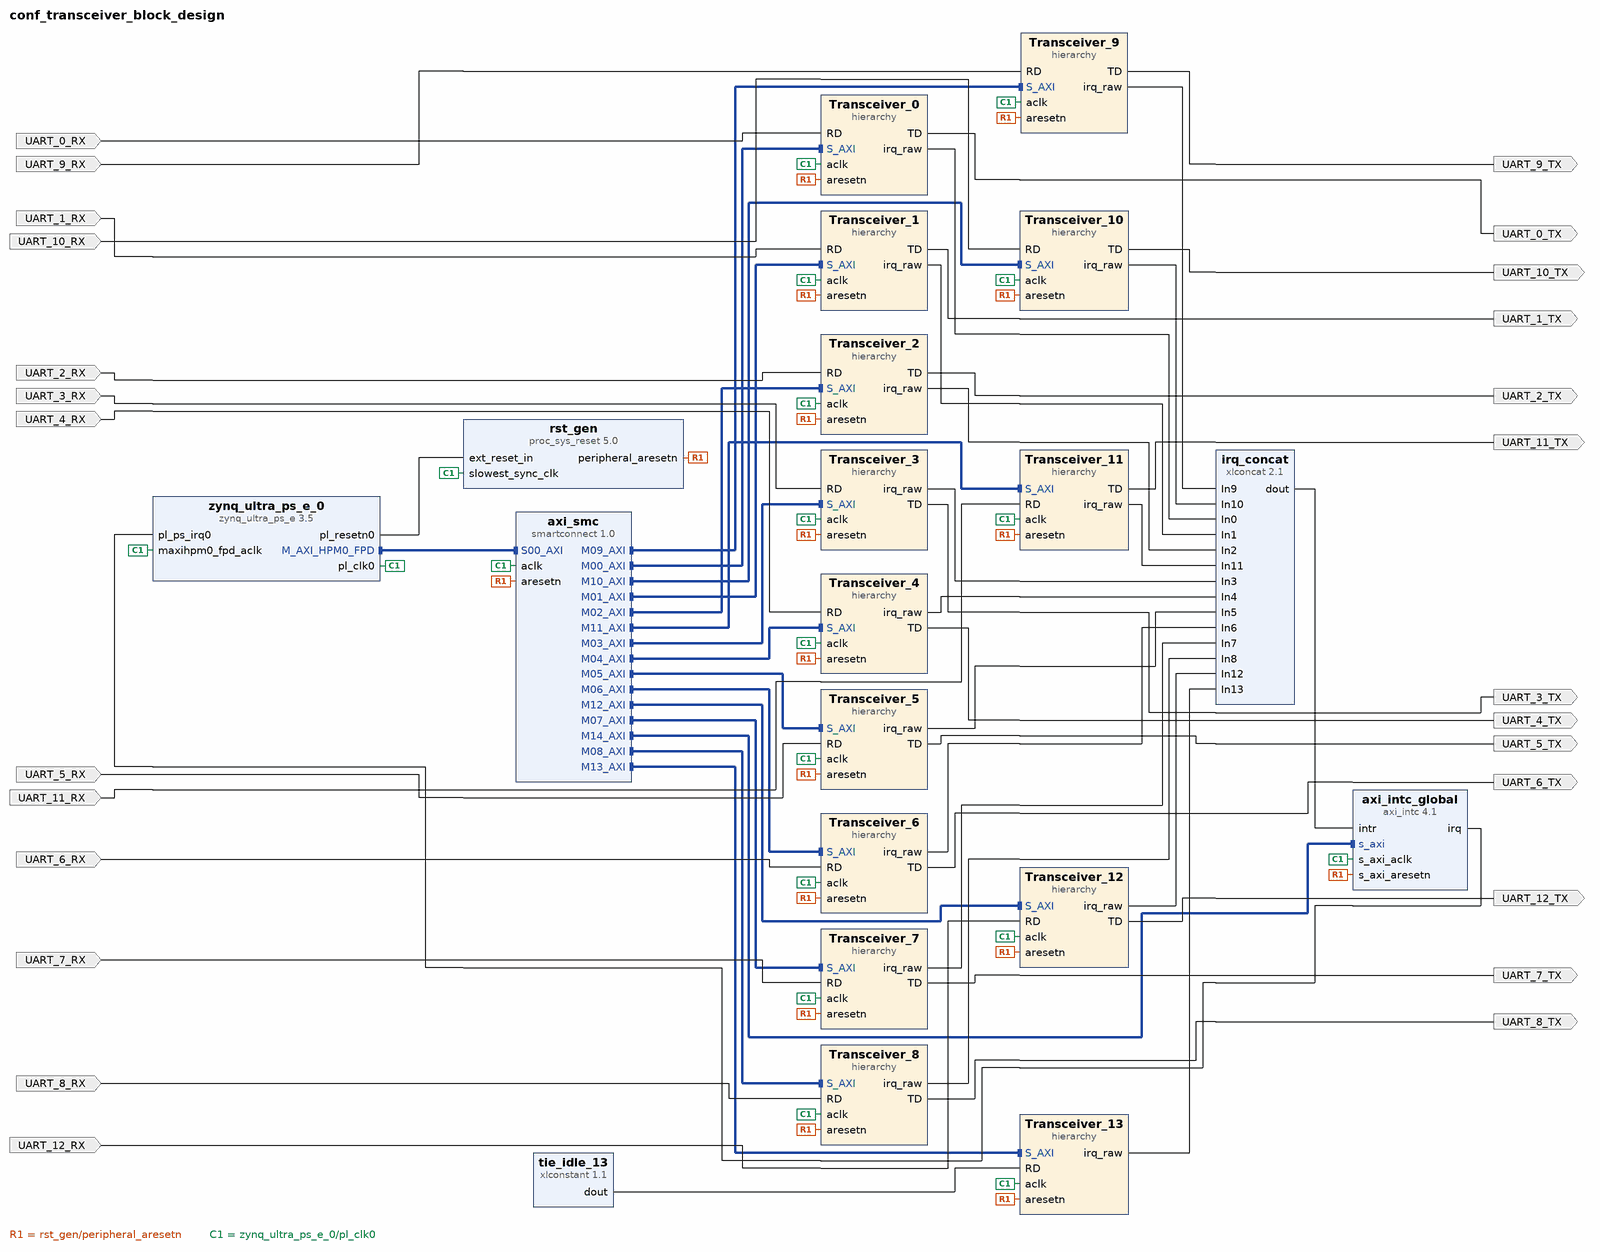
[diagram p0: block diagram of the top level]
# Vivado block design conf_transceiver_block_design, xczu9eg-ffvb1156-2-e, Vivado 2025.1
create_bd_design conf_transceiver_block_design

create_bd_port -dir I UART_0_RX
create_bd_port -dir O UART_0_TX
create_bd_port -dir I UART_1_RX
create_bd_port -dir O UART_1_TX
create_bd_port -dir I UART_2_RX
create_bd_port -dir O UART_2_TX
create_bd_port -dir I UART_3_RX
create_bd_port -dir O UART_3_TX
create_bd_port -dir I UART_4_RX
create_bd_port -dir O UART_4_TX
create_bd_port -dir I UART_5_RX
create_bd_port -dir O UART_5_TX
create_bd_port -dir I UART_6_RX
create_bd_port -dir O UART_6_TX
create_bd_port -dir I UART_7_RX
create_bd_port -dir O UART_7_TX
create_bd_port -dir I UART_8_RX
create_bd_port -dir O UART_8_TX
create_bd_port -dir I UART_9_RX
create_bd_port -dir O UART_9_TX
create_bd_port -dir I UART_10_RX
create_bd_port -dir O UART_10_TX
create_bd_port -dir I UART_11_RX
create_bd_port -dir O UART_11_TX
create_bd_port -dir I UART_12_RX
create_bd_port -dir O UART_12_TX

create_bd_cell -type ip -vlnv xilinx.com:ip:zynq_ultra_ps_e:3.5 zynq_ultra_ps_e_0
set_property -dict [list \
  CONFIG.PSU_BANK_0_IO_STANDARD LVCMOS18 \
  CONFIG.PSU_BANK_1_IO_STANDARD LVCMOS18 \
  CONFIG.PSU_BANK_2_IO_STANDARD LVCMOS18 \
  CONFIG.PSU_BANK_3_IO_STANDARD LVCMOS18 \
  CONFIG.PSU_DYNAMIC_DDR_CONFIG_EN 1 \
  CONFIG.PSU_USB3__DUAL_CLOCK_ENABLE 1 \
  CONFIG.PSU__CAN1__PERIPHERAL__ENABLE 1 \
  CONFIG.PSU__CAN1__PERIPHERAL__IO {MIO 24 .. 25} \
  CONFIG.PSU__CRF_APB__ACPU_CTRL__FREQMHZ 1200 \
  CONFIG.PSU__CRF_APB__ACPU_CTRL__SRCSEL APLL \
  CONFIG.PSU__CRF_APB__APLL_CTRL__SRCSEL PSS_REF_CLK \
  CONFIG.PSU__CRF_APB__DBG_FPD_CTRL__FREQMHZ 250 \
  CONFIG.PSU__CRF_APB__DBG_FPD_CTRL__SRCSEL IOPLL \
  CONFIG.PSU__CRF_APB__DBG_TRACE_CTRL__FREQMHZ 250 \
  CONFIG.PSU__CRF_APB__DBG_TRACE_CTRL__SRCSEL IOPLL \
  CONFIG.PSU__CRF_APB__DBG_TSTMP_CTRL__FREQMHZ 250 \
  CONFIG.PSU__CRF_APB__DBG_TSTMP_CTRL__SRCSEL IOPLL \
  CONFIG.PSU__CRF_APB__DDR_CTRL__FREQMHZ 1067 \
  CONFIG.PSU__CRF_APB__DDR_CTRL__SRCSEL DPLL \
  CONFIG.PSU__CRF_APB__DPDMA_REF_CTRL__FREQMHZ 600 \
  CONFIG.PSU__CRF_APB__DPDMA_REF_CTRL__SRCSEL APLL \
  CONFIG.PSU__CRF_APB__DPLL_CTRL__SRCSEL PSS_REF_CLK \
  CONFIG.PSU__CRF_APB__DP_AUDIO_REF_CTRL__SRCSEL RPLL \
  CONFIG.PSU__CRF_APB__DP_STC_REF_CTRL__SRCSEL RPLL \
  CONFIG.PSU__CRF_APB__DP_VIDEO_REF_CTRL__SRCSEL VPLL \
  CONFIG.PSU__CRF_APB__GDMA_REF_CTRL__FREQMHZ 600 \
  CONFIG.PSU__CRF_APB__GDMA_REF_CTRL__SRCSEL APLL \
  CONFIG.PSU__CRF_APB__GPU_REF_CTRL__FREQMHZ 500 \
  CONFIG.PSU__CRF_APB__GPU_REF_CTRL__SRCSEL IOPLL \
  CONFIG.PSU__CRF_APB__TOPSW_LSBUS_CTRL__FREQMHZ 100 \
  CONFIG.PSU__CRF_APB__TOPSW_LSBUS_CTRL__SRCSEL IOPLL \
  CONFIG.PSU__CRF_APB__TOPSW_MAIN_CTRL__FREQMHZ 533.33 \
  CONFIG.PSU__CRF_APB__TOPSW_MAIN_CTRL__SRCSEL DPLL \
  CONFIG.PSU__CRF_APB__VPLL_CTRL__SRCSEL PSS_REF_CLK \
  CONFIG.PSU__CRL_APB__ADMA_REF_CTRL__FREQMHZ 500 \
  CONFIG.PSU__CRL_APB__ADMA_REF_CTRL__SRCSEL IOPLL \
  CONFIG.PSU__CRL_APB__CAN1_REF_CTRL__FREQMHZ 100 \
  CONFIG.PSU__CRL_APB__CAN1_REF_CTRL__SRCSEL IOPLL \
  CONFIG.PSU__CRL_APB__CPU_R5_CTRL__FREQMHZ 500 \
  CONFIG.PSU__CRL_APB__CPU_R5_CTRL__SRCSEL IOPLL \
  CONFIG.PSU__CRL_APB__DBG_LPD_CTRL__FREQMHZ 250 \
  CONFIG.PSU__CRL_APB__DBG_LPD_CTRL__SRCSEL IOPLL \
  CONFIG.PSU__CRL_APB__GEM3_REF_CTRL__FREQMHZ 125 \
  CONFIG.PSU__CRL_APB__GEM3_REF_CTRL__SRCSEL IOPLL \
  CONFIG.PSU__CRL_APB__I2C0_REF_CTRL__FREQMHZ 100 \
  CONFIG.PSU__CRL_APB__I2C0_REF_CTRL__SRCSEL IOPLL \
  CONFIG.PSU__CRL_APB__I2C1_REF_CTRL__FREQMHZ 100 \
  CONFIG.PSU__CRL_APB__I2C1_REF_CTRL__SRCSEL IOPLL \
  CONFIG.PSU__CRL_APB__IOPLL_CTRL__SRCSEL PSS_REF_CLK \
  CONFIG.PSU__CRL_APB__IOU_SWITCH_CTRL__FREQMHZ 250 \
  CONFIG.PSU__CRL_APB__IOU_SWITCH_CTRL__SRCSEL IOPLL \
  CONFIG.PSU__CRL_APB__LPD_LSBUS_CTRL__FREQMHZ 100 \
  CONFIG.PSU__CRL_APB__LPD_LSBUS_CTRL__SRCSEL IOPLL \
  CONFIG.PSU__CRL_APB__LPD_SWITCH_CTRL__FREQMHZ 500 \
  CONFIG.PSU__CRL_APB__LPD_SWITCH_CTRL__SRCSEL IOPLL \
  CONFIG.PSU__CRL_APB__PCAP_CTRL__FREQMHZ 200 \
  CONFIG.PSU__CRL_APB__PCAP_CTRL__SRCSEL IOPLL \
  CONFIG.PSU__CRL_APB__PL0_REF_CTRL__FREQMHZ 100 \
  CONFIG.PSU__CRL_APB__PL0_REF_CTRL__SRCSEL IOPLL \
  CONFIG.PSU__CRL_APB__QSPI_REF_CTRL__FREQMHZ 125 \
  CONFIG.PSU__CRL_APB__QSPI_REF_CTRL__SRCSEL IOPLL \
  CONFIG.PSU__CRL_APB__RPLL_CTRL__SRCSEL PSS_REF_CLK \
  CONFIG.PSU__CRL_APB__SDIO1_REF_CTRL__FREQMHZ 200 \
  CONFIG.PSU__CRL_APB__SDIO1_REF_CTRL__SRCSEL IOPLL \
  CONFIG.PSU__CRL_APB__TIMESTAMP_REF_CTRL__FREQMHZ 100 \
  CONFIG.PSU__CRL_APB__TIMESTAMP_REF_CTRL__SRCSEL IOPLL \
  CONFIG.PSU__CRL_APB__UART0_REF_CTRL__FREQMHZ 100 \
  CONFIG.PSU__CRL_APB__UART0_REF_CTRL__SRCSEL IOPLL \
  CONFIG.PSU__CRL_APB__UART1_REF_CTRL__FREQMHZ 100 \
  CONFIG.PSU__CRL_APB__UART1_REF_CTRL__SRCSEL IOPLL \
  CONFIG.PSU__CRL_APB__USB0_BUS_REF_CTRL__FREQMHZ 250 \
  CONFIG.PSU__CRL_APB__USB0_BUS_REF_CTRL__SRCSEL IOPLL \
  CONFIG.PSU__CRL_APB__USB3_DUAL_REF_CTRL__FREQMHZ 20 \
  CONFIG.PSU__CRL_APB__USB3_DUAL_REF_CTRL__SRCSEL IOPLL \
  CONFIG.PSU__CRL_APB__USB3__ENABLE 1 \
  CONFIG.PSU__CSUPMU__PERIPHERAL__VALID 1 \
  CONFIG.PSU__DDRC__BUS_WIDTH {64 Bit} \
  CONFIG.PSU__DDRC__COMPONENTS UDIMM \
  CONFIG.PSU__DDRC__DEVICE_CAPACITY {4096 MBits} \
  CONFIG.PSU__DDRC__DRAM_WIDTH {8 Bits} \
  CONFIG.PSU__DDRC__ECC Disabled \
  CONFIG.PSU__DDRC__MEMORY_TYPE {DDR 4} \
  CONFIG.PSU__DDRC__SPEED_BIN DDR4_2133P \
  CONFIG.PSU__DDR_HIGH_ADDRESS_GUI_ENABLE 1 \
  CONFIG.PSU__DDR__INTERFACE__FREQMHZ 533.500 \
  CONFIG.PSU__DISPLAYPORT__LANE0__ENABLE 1 \
  CONFIG.PSU__DISPLAYPORT__LANE0__IO {GT Lane1} \
  CONFIG.PSU__DISPLAYPORT__LANE1__ENABLE 0 \
  CONFIG.PSU__DISPLAYPORT__PERIPHERAL__ENABLE 1 \
  CONFIG.PSU__DLL__ISUSED 1 \
  CONFIG.PSU__DPAUX__PERIPHERAL__ENABLE 1 \
  CONFIG.PSU__DPAUX__PERIPHERAL__IO {MIO 27 .. 30} \
  CONFIG.PSU__DP__LANE_SEL {Single Lower} \
  CONFIG.PSU__DP__REF_CLK_FREQ 27 \
  CONFIG.PSU__DP__REF_CLK_SEL {Ref Clk3} \
  CONFIG.PSU__ENET3__FIFO__ENABLE 0 \
  CONFIG.PSU__ENET3__GRP_MDIO__ENABLE 1 \
  CONFIG.PSU__ENET3__GRP_MDIO__IO {MIO 76 .. 77} \
  CONFIG.PSU__ENET3__PERIPHERAL__ENABLE 1 \
  CONFIG.PSU__ENET3__PERIPHERAL__IO {MIO 64 .. 75} \
  CONFIG.PSU__ENET3__PTP__ENABLE 0 \
  CONFIG.PSU__ENET3__TSU__ENABLE 0 \
  CONFIG.PSU__FPGA_PL0_ENABLE 1 \
  CONFIG.PSU__GEM3_COHERENCY 0 \
  CONFIG.PSU__GEM3_ROUTE_THROUGH_FPD 0 \
  CONFIG.PSU__GEM__TSU__ENABLE 0 \
  CONFIG.PSU__GPIO0_MIO__IO {MIO 0 .. 25} \
  CONFIG.PSU__GPIO0_MIO__PERIPHERAL__ENABLE 1 \
  CONFIG.PSU__GPIO1_MIO__IO {MIO 26 .. 51} \
  CONFIG.PSU__GPIO1_MIO__PERIPHERAL__ENABLE 1 \
  CONFIG.PSU__GT__LINK_SPEED HBR \
  CONFIG.PSU__GT__PRE_EMPH_LVL_4 0 \
  CONFIG.PSU__GT__VLT_SWNG_LVL_4 0 \
  CONFIG.PSU__I2C0__PERIPHERAL__ENABLE 1 \
  CONFIG.PSU__I2C0__PERIPHERAL__IO {MIO 14 .. 15} \
  CONFIG.PSU__I2C1__PERIPHERAL__ENABLE 1 \
  CONFIG.PSU__I2C1__PERIPHERAL__IO {MIO 16 .. 17} \
  CONFIG.PSU__IOU_SLCR__IOU_TTC_APB_CLK__TTC0_SEL APB \
  CONFIG.PSU__IOU_SLCR__IOU_TTC_APB_CLK__TTC1_SEL APB \
  CONFIG.PSU__IOU_SLCR__IOU_TTC_APB_CLK__TTC2_SEL APB \
  CONFIG.PSU__IOU_SLCR__IOU_TTC_APB_CLK__TTC3_SEL APB \
  CONFIG.PSU__MAXIGP0__DATA_WIDTH 128 \
  CONFIG.PSU__OVERRIDE__BASIC_CLOCK 0 \
  CONFIG.PSU__PCIE__BAR0_VAL 0x0 \
  CONFIG.PSU__PCIE__BAR1_VAL 0x0 \
  CONFIG.PSU__PCIE__BAR2_VAL 0x0 \
  CONFIG.PSU__PCIE__BAR3_VAL 0x0 \
  CONFIG.PSU__PCIE__BAR4_VAL 0x0 \
  CONFIG.PSU__PCIE__BAR5_VAL 0x0 \
  CONFIG.PSU__PCIE__CLASS_CODE_BASE 0x06 \
  CONFIG.PSU__PCIE__CLASS_CODE_INTERFACE 0x0 \
  CONFIG.PSU__PCIE__CLASS_CODE_SUB 0x4 \
  CONFIG.PSU__PCIE__CLASS_CODE_VALUE 0x60400 \
  CONFIG.PSU__PCIE__CRS_SW_VISIBILITY 1 \
  CONFIG.PSU__PCIE__DEVICE_ID 0xD021 \
  CONFIG.PSU__PCIE__DEVICE_PORT_TYPE {Root Port} \
  CONFIG.PSU__PCIE__EROM_VAL 0x0 \
  CONFIG.PSU__PCIE__LANE0__ENABLE 1 \
  CONFIG.PSU__PCIE__LANE0__IO {GT Lane0} \
  CONFIG.PSU__PCIE__LINK_SPEED {5.0 Gb/s} \
  CONFIG.PSU__PCIE__MAXIMUM_LINK_WIDTH x1 \
  CONFIG.PSU__PCIE__MAX_PAYLOAD_SIZE {256 bytes} \
  CONFIG.PSU__PCIE__PERIPHERAL__ENABLE 1 \
  CONFIG.PSU__PCIE__PERIPHERAL__ENDPOINT_ENABLE 0 \
  CONFIG.PSU__PCIE__PERIPHERAL__ROOTPORT_ENABLE 1 \
  CONFIG.PSU__PCIE__PERIPHERAL__ROOTPORT_IO {MIO 31} \
  CONFIG.PSU__PCIE__REF_CLK_FREQ 100 \
  CONFIG.PSU__PCIE__REF_CLK_SEL {Ref Clk0} \
  CONFIG.PSU__PCIE__REVISION_ID 0x0 \
  CONFIG.PSU__PCIE__SUBSYSTEM_ID 0x7 \
  CONFIG.PSU__PCIE__SUBSYSTEM_VENDOR_ID 0x10EE \
  CONFIG.PSU__PCIE__VENDOR_ID 0x10EE \
  CONFIG.PSU__PMU_COHERENCY 0 \
  CONFIG.PSU__PMU__AIBACK__ENABLE 0 \
  CONFIG.PSU__PMU__EMIO_GPI__ENABLE 0 \
  CONFIG.PSU__PMU__EMIO_GPO__ENABLE 0 \
  CONFIG.PSU__PMU__GPI0__ENABLE 0 \
  CONFIG.PSU__PMU__GPI1__ENABLE 0 \
  CONFIG.PSU__PMU__GPI2__ENABLE 0 \
  CONFIG.PSU__PMU__GPI3__ENABLE 0 \
  CONFIG.PSU__PMU__GPI4__ENABLE 0 \
  CONFIG.PSU__PMU__GPI5__ENABLE 0 \
  CONFIG.PSU__PMU__GPO0__ENABLE 0 \
  CONFIG.PSU__PMU__GPO1__ENABLE 0 \
  CONFIG.PSU__PMU__GPO2__ENABLE 1 \
  CONFIG.PSU__PMU__GPO2__IO {MIO 34} \
  CONFIG.PSU__PMU__GPO2__POLARITY high \
  CONFIG.PSU__PMU__GPO3__ENABLE 0 \
  CONFIG.PSU__PMU__GPO4__ENABLE 0 \
  CONFIG.PSU__PMU__GPO5__ENABLE 0 \
  CONFIG.PSU__PMU__PERIPHERAL__ENABLE 1 \
  CONFIG.PSU__PMU__PLERROR__ENABLE 0 \
  CONFIG.PSU__PRESET_APPLIED 1 \
  CONFIG.PSU__PSS_REF_CLK__FREQMHZ 33.330 \
  CONFIG.PSU__QSPI_COHERENCY 0 \
  CONFIG.PSU__QSPI_ROUTE_THROUGH_FPD 0 \
  CONFIG.PSU__QSPI__GRP_FBCLK__ENABLE 1 \
  CONFIG.PSU__QSPI__GRP_FBCLK__IO {MIO 6} \
  CONFIG.PSU__QSPI__PERIPHERAL__DATA_MODE x4 \
  CONFIG.PSU__QSPI__PERIPHERAL__ENABLE 1 \
  CONFIG.PSU__QSPI__PERIPHERAL__IO {MIO 0 .. 12} \
  CONFIG.PSU__QSPI__PERIPHERAL__MODE {Dual Parallel} \
  CONFIG.PSU__SATA__LANE1__IO {GT Lane3} \
  CONFIG.PSU__SATA__PERIPHERAL__ENABLE 1 \
  CONFIG.PSU__SATA__REF_CLK_FREQ 125 \
  CONFIG.PSU__SATA__REF_CLK_SEL {Ref Clk1} \
  CONFIG.PSU__SD1_COHERENCY 0 \
  CONFIG.PSU__SD1_ROUTE_THROUGH_FPD 0 \
  CONFIG.PSU__SD1__CLK_100_SDR_OTAP_DLY 0x3 \
  CONFIG.PSU__SD1__CLK_200_SDR_OTAP_DLY 0x3 \
  CONFIG.PSU__SD1__CLK_50_DDR_ITAP_DLY 0x3D \
  CONFIG.PSU__SD1__CLK_50_DDR_OTAP_DLY 0x4 \
  CONFIG.PSU__SD1__CLK_50_SDR_ITAP_DLY 0x15 \
  CONFIG.PSU__SD1__CLK_50_SDR_OTAP_DLY 0x5 \
  CONFIG.PSU__SD1__DATA_TRANSFER_MODE 8Bit \
  CONFIG.PSU__SD1__GRP_CD__ENABLE 1 \
  CONFIG.PSU__SD1__GRP_CD__IO {MIO 45} \
  CONFIG.PSU__SD1__GRP_POW__ENABLE 0 \
  CONFIG.PSU__SD1__GRP_WP__ENABLE 1 \
  CONFIG.PSU__SD1__GRP_WP__IO {MIO 44} \
  CONFIG.PSU__SD1__PERIPHERAL__ENABLE 1 \
  CONFIG.PSU__SD1__PERIPHERAL__IO {MIO 39 .. 51} \
  CONFIG.PSU__SD1__SLOT_TYPE {SD 3.0} \
  CONFIG.PSU__SWDT0__CLOCK__ENABLE 0 \
  CONFIG.PSU__SWDT0__PERIPHERAL__ENABLE 1 \
  CONFIG.PSU__SWDT0__RESET__ENABLE 0 \
  CONFIG.PSU__SWDT1__CLOCK__ENABLE 0 \
  CONFIG.PSU__SWDT1__PERIPHERAL__ENABLE 1 \
  CONFIG.PSU__SWDT1__RESET__ENABLE 0 \
  CONFIG.PSU__TSU__BUFG_PORT_PAIR 0 \
  CONFIG.PSU__TTC0__CLOCK__ENABLE 0 \
  CONFIG.PSU__TTC0__PERIPHERAL__ENABLE 1 \
  CONFIG.PSU__TTC0__WAVEOUT__ENABLE 0 \
  CONFIG.PSU__TTC1__CLOCK__ENABLE 0 \
  CONFIG.PSU__TTC1__PERIPHERAL__ENABLE 1 \
  CONFIG.PSU__TTC1__WAVEOUT__ENABLE 0 \
  CONFIG.PSU__TTC2__CLOCK__ENABLE 0 \
  CONFIG.PSU__TTC2__PERIPHERAL__ENABLE 1 \
  CONFIG.PSU__TTC2__WAVEOUT__ENABLE 0 \
  CONFIG.PSU__TTC3__CLOCK__ENABLE 0 \
  CONFIG.PSU__TTC3__PERIPHERAL__ENABLE 1 \
  CONFIG.PSU__TTC3__WAVEOUT__ENABLE 0 \
  CONFIG.PSU__UART0__BAUD_RATE 115200 \
  CONFIG.PSU__UART0__MODEM__ENABLE 0 \
  CONFIG.PSU__UART0__PERIPHERAL__ENABLE 1 \
  CONFIG.PSU__UART0__PERIPHERAL__IO {MIO 18 .. 19} \
  CONFIG.PSU__UART1__BAUD_RATE 115200 \
  CONFIG.PSU__UART1__MODEM__ENABLE 0 \
  CONFIG.PSU__UART1__PERIPHERAL__ENABLE 1 \
  CONFIG.PSU__UART1__PERIPHERAL__IO {MIO 20 .. 21} \
  CONFIG.PSU__USB0_COHERENCY 0 \
  CONFIG.PSU__USB0__PERIPHERAL__ENABLE 1 \
  CONFIG.PSU__USB0__PERIPHERAL__IO {MIO 52 .. 63} \
  CONFIG.PSU__USB0__REF_CLK_FREQ 26 \
  CONFIG.PSU__USB0__REF_CLK_SEL {Ref Clk2} \
  CONFIG.PSU__USB2_0__EMIO__ENABLE 0 \
  CONFIG.PSU__USB3_0__EMIO__ENABLE 0 \
  CONFIG.PSU__USB3_0__PERIPHERAL__ENABLE 1 \
  CONFIG.PSU__USB3_0__PERIPHERAL__IO {GT Lane2} \
  CONFIG.PSU__USB__RESET__MODE {Boot Pin} \
  CONFIG.PSU__USB__RESET__POLARITY {Active Low} \
  CONFIG.PSU__USE__IRQ0 1 \
  CONFIG.PSU__USE__M_AXI_GP0 1 \
  CONFIG.PSU__USE__M_AXI_GP1 0 \
  CONFIG.PSU__USE__M_AXI_GP2 0 \
] [get_bd_cells zynq_ultra_ps_e_0]
# 111 more settings of zynq_ultra_ps_e_0 are not shown: defaults, MIO pin electricals, DDR timing, and values the tool derives
create_bd_cell -type ip -vlnv xilinx.com:ip:proc_sys_reset:5.0 rst_gen
create_bd_cell -type ip -vlnv xilinx.com:ip:smartconnect:1.0 axi_smc
set_property -dict {CONFIG.NUM_MI 15 CONFIG.NUM_SI 1} [get_bd_cells axi_smc]
create_bd_cell -type ip -vlnv xilinx.com:ip:xlconcat:2.1 irq_concat
set_property -dict {CONFIG.NUM_PORTS 14} [get_bd_cells irq_concat]
create_bd_cell -type ip -vlnv xilinx.com:ip:axi_intc:4.1 axi_intc_global
set_property -dict [list \
  CONFIG.C_IRQ_CONNECTION 1 \
  CONFIG.C_KIND_OF_EDGE 0x0AAAAAAA \
  CONFIG.C_KIND_OF_INTR 0xFFFFFFFF \
] [get_bd_cells axi_intc_global]
create_bd_cell -type hier Transceiver_0
create_bd_cell -type hier Transceiver_1
create_bd_cell -type hier Transceiver_2
create_bd_cell -type hier Transceiver_3
create_bd_cell -type hier Transceiver_4
create_bd_cell -type hier Transceiver_5
create_bd_cell -type hier Transceiver_6
create_bd_cell -type hier Transceiver_7
create_bd_cell -type hier Transceiver_8
create_bd_cell -type hier Transceiver_9
create_bd_cell -type hier Transceiver_10
create_bd_cell -type hier Transceiver_11
create_bd_cell -type hier Transceiver_12
create_bd_cell -type hier Transceiver_13
create_bd_cell -type ip -vlnv xilinx.com:ip:xlconstant:1.1 tie_idle_13
set_property -dict {CONFIG.CONST_VAL 1} [get_bd_cells tie_idle_13]

# ---- hierarchy /Transceiver_0 ----
current_bd_instance /Transceiver_0
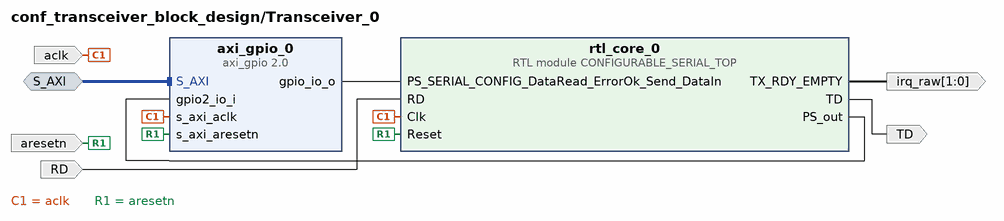
[diagram p1: block diagram inside /Transceiver_0]
create_bd_intf_pin -mode Slave -vlnv xilinx.com:interface:aximm_rtl:1.0 S_AXI
create_bd_pin -dir I -type clk aclk
create_bd_pin -dir I -type rst aresetn
create_bd_pin -dir I RD
create_bd_pin -dir O TD
create_bd_pin -dir O -from 1 -to 0 irq_raw

create_bd_cell -type module -reference CONFIGURABLE_SERIAL_TOP rtl_core_0
create_bd_cell -type ip -vlnv xilinx.com:ip:axi_gpio:2.0 axi_gpio_0
set_property -dict [list \
  CONFIG.C_ALL_INPUTS_2 1 \
  CONFIG.C_ALL_OUTPUTS 1 \
  CONFIG.C_GPIO2_WIDTH 14 \
  CONFIG.C_GPIO_WIDTH 27 \
  CONFIG.C_IS_DUAL 1 \
] [get_bd_cells axi_gpio_0]

# ---- hierarchy /Transceiver_1 ----
current_bd_instance /Transceiver_1
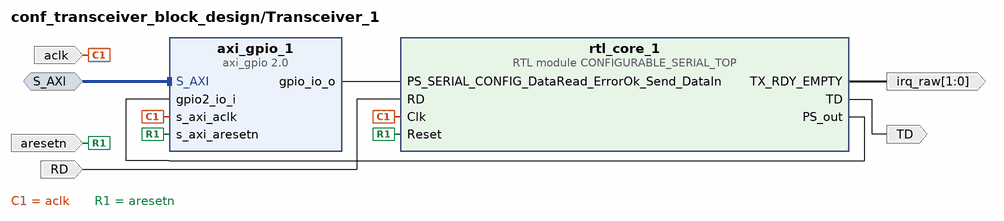
[diagram p2: block diagram inside /Transceiver_1]
create_bd_intf_pin -mode Slave -vlnv xilinx.com:interface:aximm_rtl:1.0 S_AXI
create_bd_pin -dir I -type clk aclk
create_bd_pin -dir I -type rst aresetn
create_bd_pin -dir I RD
create_bd_pin -dir O TD
create_bd_pin -dir O -from 1 -to 0 irq_raw

create_bd_cell -type module -reference CONFIGURABLE_SERIAL_TOP rtl_core_1
create_bd_cell -type ip -vlnv xilinx.com:ip:axi_gpio:2.0 axi_gpio_1
set_property -dict [list \
  CONFIG.C_ALL_INPUTS_2 1 \
  CONFIG.C_ALL_OUTPUTS 1 \
  CONFIG.C_GPIO2_WIDTH 14 \
  CONFIG.C_GPIO_WIDTH 27 \
  CONFIG.C_IS_DUAL 1 \
] [get_bd_cells axi_gpio_1]

# ---- hierarchy /Transceiver_2 ----
current_bd_instance /Transceiver_2
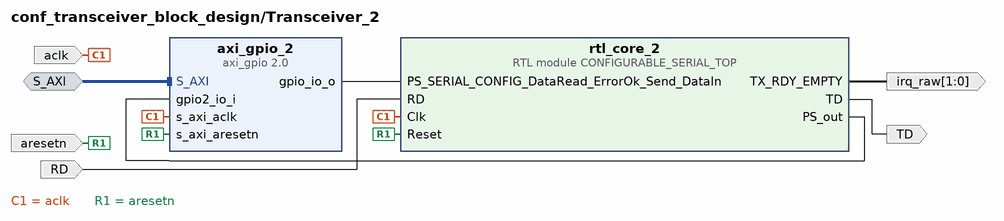
[diagram p3: block diagram inside /Transceiver_2]
create_bd_intf_pin -mode Slave -vlnv xilinx.com:interface:aximm_rtl:1.0 S_AXI
create_bd_pin -dir I -type clk aclk
create_bd_pin -dir I -type rst aresetn
create_bd_pin -dir I RD
create_bd_pin -dir O TD
create_bd_pin -dir O -from 1 -to 0 irq_raw

create_bd_cell -type module -reference CONFIGURABLE_SERIAL_TOP rtl_core_2
create_bd_cell -type ip -vlnv xilinx.com:ip:axi_gpio:2.0 axi_gpio_2
set_property -dict [list \
  CONFIG.C_ALL_INPUTS_2 1 \
  CONFIG.C_ALL_OUTPUTS 1 \
  CONFIG.C_GPIO2_WIDTH 14 \
  CONFIG.C_GPIO_WIDTH 27 \
  CONFIG.C_IS_DUAL 1 \
] [get_bd_cells axi_gpio_2]

# ---- hierarchy /Transceiver_3 ----
current_bd_instance /Transceiver_3
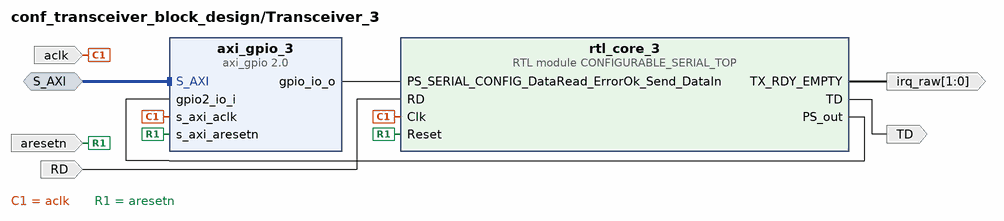
[diagram p4: block diagram inside /Transceiver_3]
create_bd_intf_pin -mode Slave -vlnv xilinx.com:interface:aximm_rtl:1.0 S_AXI
create_bd_pin -dir I -type clk aclk
create_bd_pin -dir I -type rst aresetn
create_bd_pin -dir I RD
create_bd_pin -dir O TD
create_bd_pin -dir O -from 1 -to 0 irq_raw

create_bd_cell -type module -reference CONFIGURABLE_SERIAL_TOP rtl_core_3
create_bd_cell -type ip -vlnv xilinx.com:ip:axi_gpio:2.0 axi_gpio_3
set_property -dict [list \
  CONFIG.C_ALL_INPUTS_2 1 \
  CONFIG.C_ALL_OUTPUTS 1 \
  CONFIG.C_GPIO2_WIDTH 14 \
  CONFIG.C_GPIO_WIDTH 27 \
  CONFIG.C_IS_DUAL 1 \
] [get_bd_cells axi_gpio_3]

# ---- hierarchy /Transceiver_4 ----
current_bd_instance /Transceiver_4
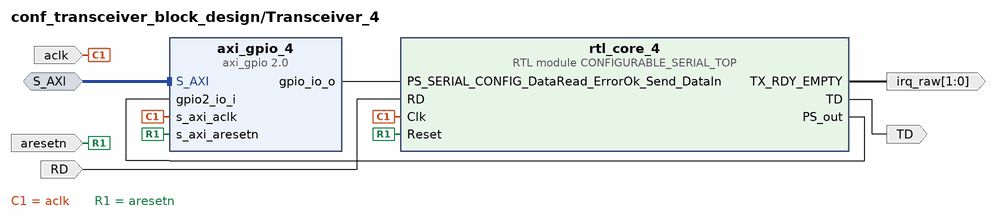
[diagram p5: block diagram inside /Transceiver_4]
create_bd_intf_pin -mode Slave -vlnv xilinx.com:interface:aximm_rtl:1.0 S_AXI
create_bd_pin -dir I -type clk aclk
create_bd_pin -dir I -type rst aresetn
create_bd_pin -dir I RD
create_bd_pin -dir O TD
create_bd_pin -dir O -from 1 -to 0 irq_raw

create_bd_cell -type module -reference CONFIGURABLE_SERIAL_TOP rtl_core_4
create_bd_cell -type ip -vlnv xilinx.com:ip:axi_gpio:2.0 axi_gpio_4
set_property -dict [list \
  CONFIG.C_ALL_INPUTS_2 1 \
  CONFIG.C_ALL_OUTPUTS 1 \
  CONFIG.C_GPIO2_WIDTH 14 \
  CONFIG.C_GPIO_WIDTH 27 \
  CONFIG.C_IS_DUAL 1 \
] [get_bd_cells axi_gpio_4]

# ---- hierarchy /Transceiver_5 ----
current_bd_instance /Transceiver_5
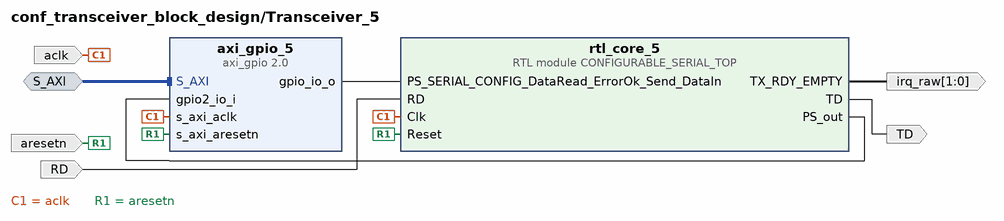
[diagram p6: block diagram inside /Transceiver_5]
create_bd_intf_pin -mode Slave -vlnv xilinx.com:interface:aximm_rtl:1.0 S_AXI
create_bd_pin -dir I -type clk aclk
create_bd_pin -dir I -type rst aresetn
create_bd_pin -dir I RD
create_bd_pin -dir O TD
create_bd_pin -dir O -from 1 -to 0 irq_raw

create_bd_cell -type module -reference CONFIGURABLE_SERIAL_TOP rtl_core_5
create_bd_cell -type ip -vlnv xilinx.com:ip:axi_gpio:2.0 axi_gpio_5
set_property -dict [list \
  CONFIG.C_ALL_INPUTS_2 1 \
  CONFIG.C_ALL_OUTPUTS 1 \
  CONFIG.C_GPIO2_WIDTH 14 \
  CONFIG.C_GPIO_WIDTH 27 \
  CONFIG.C_IS_DUAL 1 \
] [get_bd_cells axi_gpio_5]

# ---- hierarchy /Transceiver_6 ----
current_bd_instance /Transceiver_6
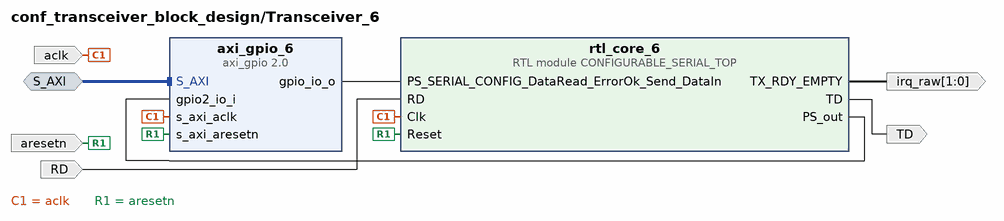
[diagram p7: block diagram inside /Transceiver_6]
create_bd_intf_pin -mode Slave -vlnv xilinx.com:interface:aximm_rtl:1.0 S_AXI
create_bd_pin -dir I -type clk aclk
create_bd_pin -dir I -type rst aresetn
create_bd_pin -dir I RD
create_bd_pin -dir O TD
create_bd_pin -dir O -from 1 -to 0 irq_raw

create_bd_cell -type module -reference CONFIGURABLE_SERIAL_TOP rtl_core_6
create_bd_cell -type ip -vlnv xilinx.com:ip:axi_gpio:2.0 axi_gpio_6
set_property -dict [list \
  CONFIG.C_ALL_INPUTS_2 1 \
  CONFIG.C_ALL_OUTPUTS 1 \
  CONFIG.C_GPIO2_WIDTH 14 \
  CONFIG.C_GPIO_WIDTH 27 \
  CONFIG.C_IS_DUAL 1 \
] [get_bd_cells axi_gpio_6]

# ---- hierarchy /Transceiver_7 ----
current_bd_instance /Transceiver_7
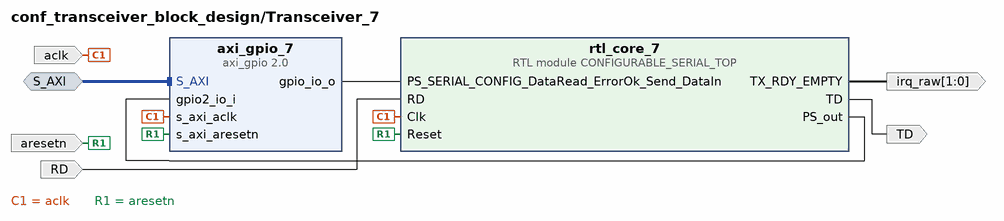
[diagram p8: block diagram inside /Transceiver_7]
create_bd_intf_pin -mode Slave -vlnv xilinx.com:interface:aximm_rtl:1.0 S_AXI
create_bd_pin -dir I -type clk aclk
create_bd_pin -dir I -type rst aresetn
create_bd_pin -dir I RD
create_bd_pin -dir O TD
create_bd_pin -dir O -from 1 -to 0 irq_raw

create_bd_cell -type module -reference CONFIGURABLE_SERIAL_TOP rtl_core_7
create_bd_cell -type ip -vlnv xilinx.com:ip:axi_gpio:2.0 axi_gpio_7
set_property -dict [list \
  CONFIG.C_ALL_INPUTS_2 1 \
  CONFIG.C_ALL_OUTPUTS 1 \
  CONFIG.C_GPIO2_WIDTH 14 \
  CONFIG.C_GPIO_WIDTH 27 \
  CONFIG.C_IS_DUAL 1 \
] [get_bd_cells axi_gpio_7]

# ---- hierarchy /Transceiver_8 ----
current_bd_instance /Transceiver_8
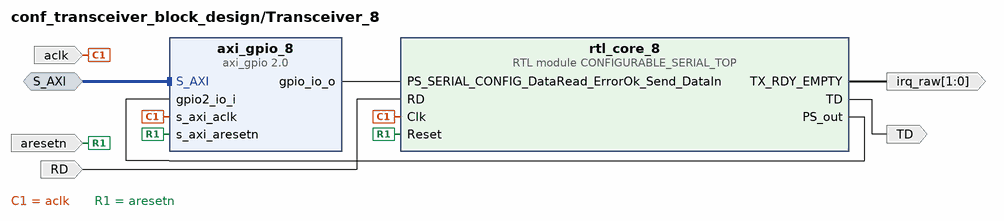
[diagram p9: block diagram inside /Transceiver_8]
create_bd_intf_pin -mode Slave -vlnv xilinx.com:interface:aximm_rtl:1.0 S_AXI
create_bd_pin -dir I -type clk aclk
create_bd_pin -dir I -type rst aresetn
create_bd_pin -dir I RD
create_bd_pin -dir O TD
create_bd_pin -dir O -from 1 -to 0 irq_raw

create_bd_cell -type module -reference CONFIGURABLE_SERIAL_TOP rtl_core_8
create_bd_cell -type ip -vlnv xilinx.com:ip:axi_gpio:2.0 axi_gpio_8
set_property -dict [list \
  CONFIG.C_ALL_INPUTS_2 1 \
  CONFIG.C_ALL_OUTPUTS 1 \
  CONFIG.C_GPIO2_WIDTH 14 \
  CONFIG.C_GPIO_WIDTH 27 \
  CONFIG.C_IS_DUAL 1 \
] [get_bd_cells axi_gpio_8]

# ---- hierarchy /Transceiver_9 ----
current_bd_instance /Transceiver_9
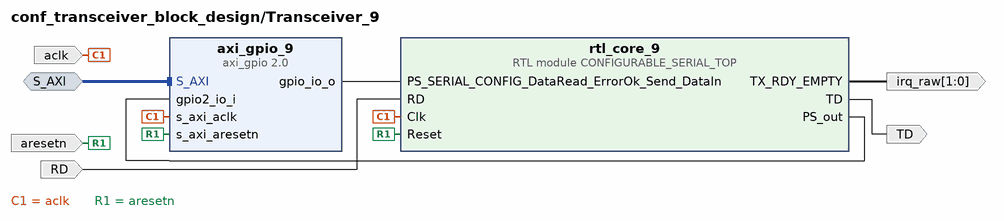
[diagram p10: block diagram inside /Transceiver_9]
create_bd_intf_pin -mode Slave -vlnv xilinx.com:interface:aximm_rtl:1.0 S_AXI
create_bd_pin -dir I -type clk aclk
create_bd_pin -dir I -type rst aresetn
create_bd_pin -dir I RD
create_bd_pin -dir O TD
create_bd_pin -dir O -from 1 -to 0 irq_raw

create_bd_cell -type module -reference CONFIGURABLE_SERIAL_TOP rtl_core_9
create_bd_cell -type ip -vlnv xilinx.com:ip:axi_gpio:2.0 axi_gpio_9
set_property -dict [list \
  CONFIG.C_ALL_INPUTS_2 1 \
  CONFIG.C_ALL_OUTPUTS 1 \
  CONFIG.C_GPIO2_WIDTH 14 \
  CONFIG.C_GPIO_WIDTH 27 \
  CONFIG.C_IS_DUAL 1 \
] [get_bd_cells axi_gpio_9]

# ---- hierarchy /Transceiver_10 ----
current_bd_instance /Transceiver_10
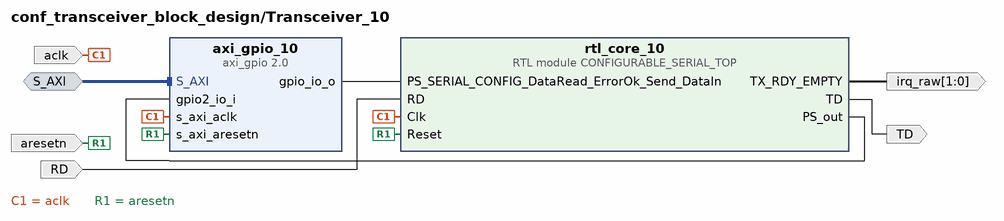
[diagram p11: block diagram inside /Transceiver_10]
create_bd_intf_pin -mode Slave -vlnv xilinx.com:interface:aximm_rtl:1.0 S_AXI
create_bd_pin -dir I -type clk aclk
create_bd_pin -dir I -type rst aresetn
create_bd_pin -dir I RD
create_bd_pin -dir O TD
create_bd_pin -dir O -from 1 -to 0 irq_raw

create_bd_cell -type module -reference CONFIGURABLE_SERIAL_TOP rtl_core_10
create_bd_cell -type ip -vlnv xilinx.com:ip:axi_gpio:2.0 axi_gpio_10
set_property -dict [list \
  CONFIG.C_ALL_INPUTS_2 1 \
  CONFIG.C_ALL_OUTPUTS 1 \
  CONFIG.C_GPIO2_WIDTH 14 \
  CONFIG.C_GPIO_WIDTH 27 \
  CONFIG.C_IS_DUAL 1 \
] [get_bd_cells axi_gpio_10]

# ---- hierarchy /Transceiver_11 ----
current_bd_instance /Transceiver_11
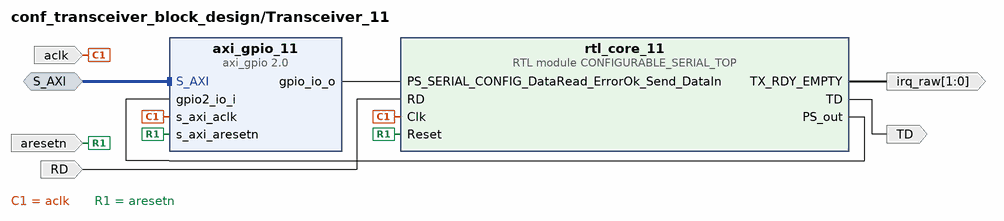
[diagram p12: block diagram inside /Transceiver_11]
create_bd_intf_pin -mode Slave -vlnv xilinx.com:interface:aximm_rtl:1.0 S_AXI
create_bd_pin -dir I -type clk aclk
create_bd_pin -dir I -type rst aresetn
create_bd_pin -dir I RD
create_bd_pin -dir O TD
create_bd_pin -dir O -from 1 -to 0 irq_raw

create_bd_cell -type module -reference CONFIGURABLE_SERIAL_TOP rtl_core_11
create_bd_cell -type ip -vlnv xilinx.com:ip:axi_gpio:2.0 axi_gpio_11
set_property -dict [list \
  CONFIG.C_ALL_INPUTS_2 1 \
  CONFIG.C_ALL_OUTPUTS 1 \
  CONFIG.C_GPIO2_WIDTH 14 \
  CONFIG.C_GPIO_WIDTH 27 \
  CONFIG.C_IS_DUAL 1 \
] [get_bd_cells axi_gpio_11]

# ---- hierarchy /Transceiver_12 ----
current_bd_instance /Transceiver_12
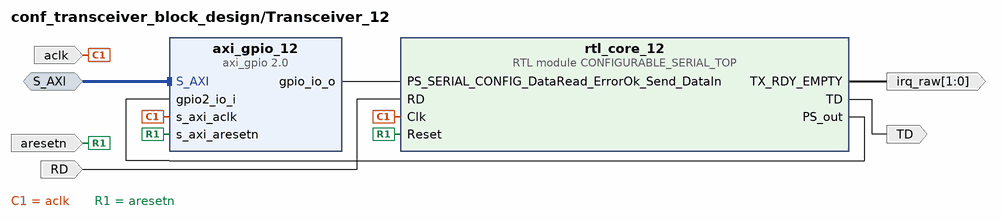
[diagram p13: block diagram inside /Transceiver_12]
create_bd_intf_pin -mode Slave -vlnv xilinx.com:interface:aximm_rtl:1.0 S_AXI
create_bd_pin -dir I -type clk aclk
create_bd_pin -dir I -type rst aresetn
create_bd_pin -dir I RD
create_bd_pin -dir O TD
create_bd_pin -dir O -from 1 -to 0 irq_raw

create_bd_cell -type module -reference CONFIGURABLE_SERIAL_TOP rtl_core_12
create_bd_cell -type ip -vlnv xilinx.com:ip:axi_gpio:2.0 axi_gpio_12
set_property -dict [list \
  CONFIG.C_ALL_INPUTS_2 1 \
  CONFIG.C_ALL_OUTPUTS 1 \
  CONFIG.C_GPIO2_WIDTH 14 \
  CONFIG.C_GPIO_WIDTH 27 \
  CONFIG.C_IS_DUAL 1 \
] [get_bd_cells axi_gpio_12]

# ---- hierarchy /Transceiver_13 ----
current_bd_instance /Transceiver_13
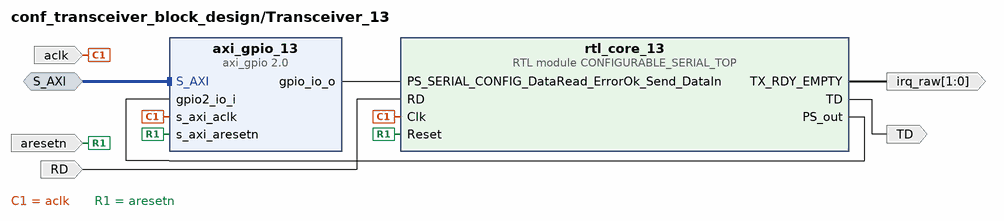
[diagram p14: block diagram inside /Transceiver_13]
create_bd_intf_pin -mode Slave -vlnv xilinx.com:interface:aximm_rtl:1.0 S_AXI
create_bd_pin -dir I -type clk aclk
create_bd_pin -dir I -type rst aresetn
create_bd_pin -dir I RD
create_bd_pin -dir O TD
create_bd_pin -dir O -from 1 -to 0 irq_raw

create_bd_cell -type module -reference CONFIGURABLE_SERIAL_TOP rtl_core_13
create_bd_cell -type ip -vlnv xilinx.com:ip:axi_gpio:2.0 axi_gpio_13
set_property -dict [list \
  CONFIG.C_ALL_INPUTS_2 1 \
  CONFIG.C_ALL_OUTPUTS 1 \
  CONFIG.C_GPIO2_WIDTH 14 \
  CONFIG.C_GPIO_WIDTH 27 \
  CONFIG.C_IS_DUAL 1 \
] [get_bd_cells axi_gpio_13]

# ---- connections ----

current_bd_instance /Transceiver_0
connect_bd_intf_net [get_bd_intf_pins S_AXI] [get_bd_intf_pins axi_gpio_0/S_AXI]
connect_bd_net [get_bd_pins RD] [get_bd_pins rtl_core_0/RD]
connect_bd_net [get_bd_pins aclk] [get_bd_pins axi_gpio_0/s_axi_aclk] [get_bd_pins rtl_core_0/Clk]
connect_bd_net [get_bd_pins aresetn] [get_bd_pins axi_gpio_0/s_axi_aresetn] [get_bd_pins rtl_core_0/Reset]
connect_bd_net [get_bd_pins axi_gpio_0/gpio_io_o] [get_bd_pins rtl_core_0/PS_SERIAL_CONFIG_DataRead_ErrorOk_Send_DataIn]
connect_bd_net [get_bd_pins rtl_core_0/PS_out] [get_bd_pins axi_gpio_0/gpio2_io_i]
connect_bd_net [get_bd_pins rtl_core_0/TD] [get_bd_pins TD]
connect_bd_net [get_bd_pins rtl_core_0/TX_RDY_EMPTY] [get_bd_pins irq_raw]

current_bd_instance /Transceiver_1
connect_bd_intf_net [get_bd_intf_pins S_AXI] [get_bd_intf_pins axi_gpio_1/S_AXI]
connect_bd_net [get_bd_pins RD] [get_bd_pins rtl_core_1/RD]
connect_bd_net [get_bd_pins aclk] [get_bd_pins axi_gpio_1/s_axi_aclk] [get_bd_pins rtl_core_1/Clk]
connect_bd_net [get_bd_pins aresetn] [get_bd_pins axi_gpio_1/s_axi_aresetn] [get_bd_pins rtl_core_1/Reset]
connect_bd_net [get_bd_pins axi_gpio_1/gpio_io_o] [get_bd_pins rtl_core_1/PS_SERIAL_CONFIG_DataRead_ErrorOk_Send_DataIn]
connect_bd_net [get_bd_pins rtl_core_1/PS_out] [get_bd_pins axi_gpio_1/gpio2_io_i]
connect_bd_net [get_bd_pins rtl_core_1/TD] [get_bd_pins TD]
connect_bd_net [get_bd_pins rtl_core_1/TX_RDY_EMPTY] [get_bd_pins irq_raw]

current_bd_instance /Transceiver_2
connect_bd_intf_net [get_bd_intf_pins S_AXI] [get_bd_intf_pins axi_gpio_2/S_AXI]
connect_bd_net [get_bd_pins RD] [get_bd_pins rtl_core_2/RD]
connect_bd_net [get_bd_pins aclk] [get_bd_pins axi_gpio_2/s_axi_aclk] [get_bd_pins rtl_core_2/Clk]
connect_bd_net [get_bd_pins aresetn] [get_bd_pins axi_gpio_2/s_axi_aresetn] [get_bd_pins rtl_core_2/Reset]
connect_bd_net [get_bd_pins axi_gpio_2/gpio_io_o] [get_bd_pins rtl_core_2/PS_SERIAL_CONFIG_DataRead_ErrorOk_Send_DataIn]
connect_bd_net [get_bd_pins rtl_core_2/PS_out] [get_bd_pins axi_gpio_2/gpio2_io_i]
connect_bd_net [get_bd_pins rtl_core_2/TD] [get_bd_pins TD]
connect_bd_net [get_bd_pins rtl_core_2/TX_RDY_EMPTY] [get_bd_pins irq_raw]

current_bd_instance /Transceiver_3
connect_bd_intf_net [get_bd_intf_pins S_AXI] [get_bd_intf_pins axi_gpio_3/S_AXI]
connect_bd_net [get_bd_pins RD] [get_bd_pins rtl_core_3/RD]
connect_bd_net [get_bd_pins aclk] [get_bd_pins axi_gpio_3/s_axi_aclk] [get_bd_pins rtl_core_3/Clk]
connect_bd_net [get_bd_pins aresetn] [get_bd_pins axi_gpio_3/s_axi_aresetn] [get_bd_pins rtl_core_3/Reset]
connect_bd_net [get_bd_pins axi_gpio_3/gpio_io_o] [get_bd_pins rtl_core_3/PS_SERIAL_CONFIG_DataRead_ErrorOk_Send_DataIn]
connect_bd_net [get_bd_pins rtl_core_3/PS_out] [get_bd_pins axi_gpio_3/gpio2_io_i]
connect_bd_net [get_bd_pins rtl_core_3/TD] [get_bd_pins TD]
connect_bd_net [get_bd_pins rtl_core_3/TX_RDY_EMPTY] [get_bd_pins irq_raw]

current_bd_instance /Transceiver_4
connect_bd_intf_net [get_bd_intf_pins S_AXI] [get_bd_intf_pins axi_gpio_4/S_AXI]
connect_bd_net [get_bd_pins RD] [get_bd_pins rtl_core_4/RD]
connect_bd_net [get_bd_pins aclk] [get_bd_pins axi_gpio_4/s_axi_aclk] [get_bd_pins rtl_core_4/Clk]
connect_bd_net [get_bd_pins aresetn] [get_bd_pins axi_gpio_4/s_axi_aresetn] [get_bd_pins rtl_core_4/Reset]
connect_bd_net [get_bd_pins axi_gpio_4/gpio_io_o] [get_bd_pins rtl_core_4/PS_SERIAL_CONFIG_DataRead_ErrorOk_Send_DataIn]
connect_bd_net [get_bd_pins rtl_core_4/PS_out] [get_bd_pins axi_gpio_4/gpio2_io_i]
connect_bd_net [get_bd_pins rtl_core_4/TD] [get_bd_pins TD]
connect_bd_net [get_bd_pins rtl_core_4/TX_RDY_EMPTY] [get_bd_pins irq_raw]

current_bd_instance /Transceiver_5
connect_bd_intf_net [get_bd_intf_pins S_AXI] [get_bd_intf_pins axi_gpio_5/S_AXI]
connect_bd_net [get_bd_pins RD] [get_bd_pins rtl_core_5/RD]
connect_bd_net [get_bd_pins aclk] [get_bd_pins axi_gpio_5/s_axi_aclk] [get_bd_pins rtl_core_5/Clk]
connect_bd_net [get_bd_pins aresetn] [get_bd_pins axi_gpio_5/s_axi_aresetn] [get_bd_pins rtl_core_5/Reset]
connect_bd_net [get_bd_pins axi_gpio_5/gpio_io_o] [get_bd_pins rtl_core_5/PS_SERIAL_CONFIG_DataRead_ErrorOk_Send_DataIn]
connect_bd_net [get_bd_pins rtl_core_5/PS_out] [get_bd_pins axi_gpio_5/gpio2_io_i]
connect_bd_net [get_bd_pins rtl_core_5/TD] [get_bd_pins TD]
connect_bd_net [get_bd_pins rtl_core_5/TX_RDY_EMPTY] [get_bd_pins irq_raw]

current_bd_instance /Transceiver_6
connect_bd_intf_net [get_bd_intf_pins S_AXI] [get_bd_intf_pins axi_gpio_6/S_AXI]
connect_bd_net [get_bd_pins RD] [get_bd_pins rtl_core_6/RD]
connect_bd_net [get_bd_pins aclk] [get_bd_pins axi_gpio_6/s_axi_aclk] [get_bd_pins rtl_core_6/Clk]
connect_bd_net [get_bd_pins aresetn] [get_bd_pins axi_gpio_6/s_axi_aresetn] [get_bd_pins rtl_core_6/Reset]
connect_bd_net [get_bd_pins axi_gpio_6/gpio_io_o] [get_bd_pins rtl_core_6/PS_SERIAL_CONFIG_DataRead_ErrorOk_Send_DataIn]
connect_bd_net [get_bd_pins rtl_core_6/PS_out] [get_bd_pins axi_gpio_6/gpio2_io_i]
connect_bd_net [get_bd_pins rtl_core_6/TD] [get_bd_pins TD]
connect_bd_net [get_bd_pins rtl_core_6/TX_RDY_EMPTY] [get_bd_pins irq_raw]

current_bd_instance /Transceiver_7
connect_bd_intf_net [get_bd_intf_pins S_AXI] [get_bd_intf_pins axi_gpio_7/S_AXI]
connect_bd_net [get_bd_pins RD] [get_bd_pins rtl_core_7/RD]
connect_bd_net [get_bd_pins aclk] [get_bd_pins axi_gpio_7/s_axi_aclk] [get_bd_pins rtl_core_7/Clk]
connect_bd_net [get_bd_pins aresetn] [get_bd_pins axi_gpio_7/s_axi_aresetn] [get_bd_pins rtl_core_7/Reset]
connect_bd_net [get_bd_pins axi_gpio_7/gpio_io_o] [get_bd_pins rtl_core_7/PS_SERIAL_CONFIG_DataRead_ErrorOk_Send_DataIn]
connect_bd_net [get_bd_pins rtl_core_7/PS_out] [get_bd_pins axi_gpio_7/gpio2_io_i]
connect_bd_net [get_bd_pins rtl_core_7/TD] [get_bd_pins TD]
connect_bd_net [get_bd_pins rtl_core_7/TX_RDY_EMPTY] [get_bd_pins irq_raw]

current_bd_instance /Transceiver_8
connect_bd_intf_net [get_bd_intf_pins S_AXI] [get_bd_intf_pins axi_gpio_8/S_AXI]
connect_bd_net [get_bd_pins RD] [get_bd_pins rtl_core_8/RD]
connect_bd_net [get_bd_pins aclk] [get_bd_pins axi_gpio_8/s_axi_aclk] [get_bd_pins rtl_core_8/Clk]
connect_bd_net [get_bd_pins aresetn] [get_bd_pins axi_gpio_8/s_axi_aresetn] [get_bd_pins rtl_core_8/Reset]
connect_bd_net [get_bd_pins axi_gpio_8/gpio_io_o] [get_bd_pins rtl_core_8/PS_SERIAL_CONFIG_DataRead_ErrorOk_Send_DataIn]
connect_bd_net [get_bd_pins rtl_core_8/PS_out] [get_bd_pins axi_gpio_8/gpio2_io_i]
connect_bd_net [get_bd_pins rtl_core_8/TD] [get_bd_pins TD]
connect_bd_net [get_bd_pins rtl_core_8/TX_RDY_EMPTY] [get_bd_pins irq_raw]

current_bd_instance /Transceiver_9
connect_bd_intf_net [get_bd_intf_pins S_AXI] [get_bd_intf_pins axi_gpio_9/S_AXI]
connect_bd_net [get_bd_pins RD] [get_bd_pins rtl_core_9/RD]
connect_bd_net [get_bd_pins aclk] [get_bd_pins axi_gpio_9/s_axi_aclk] [get_bd_pins rtl_core_9/Clk]
connect_bd_net [get_bd_pins aresetn] [get_bd_pins axi_gpio_9/s_axi_aresetn] [get_bd_pins rtl_core_9/Reset]
connect_bd_net [get_bd_pins axi_gpio_9/gpio_io_o] [get_bd_pins rtl_core_9/PS_SERIAL_CONFIG_DataRead_ErrorOk_Send_DataIn]
connect_bd_net [get_bd_pins rtl_core_9/PS_out] [get_bd_pins axi_gpio_9/gpio2_io_i]
connect_bd_net [get_bd_pins rtl_core_9/TD] [get_bd_pins TD]
connect_bd_net [get_bd_pins rtl_core_9/TX_RDY_EMPTY] [get_bd_pins irq_raw]

current_bd_instance /Transceiver_10
connect_bd_intf_net [get_bd_intf_pins S_AXI] [get_bd_intf_pins axi_gpio_10/S_AXI]
connect_bd_net [get_bd_pins RD] [get_bd_pins rtl_core_10/RD]
connect_bd_net [get_bd_pins aclk] [get_bd_pins axi_gpio_10/s_axi_aclk] [get_bd_pins rtl_core_10/Clk]
connect_bd_net [get_bd_pins aresetn] [get_bd_pins axi_gpio_10/s_axi_aresetn] [get_bd_pins rtl_core_10/Reset]
connect_bd_net [get_bd_pins axi_gpio_10/gpio_io_o] [get_bd_pins rtl_core_10/PS_SERIAL_CONFIG_DataRead_ErrorOk_Send_DataIn]
connect_bd_net [get_bd_pins rtl_core_10/PS_out] [get_bd_pins axi_gpio_10/gpio2_io_i]
connect_bd_net [get_bd_pins rtl_core_10/TD] [get_bd_pins TD]
connect_bd_net [get_bd_pins rtl_core_10/TX_RDY_EMPTY] [get_bd_pins irq_raw]

current_bd_instance /Transceiver_11
connect_bd_intf_net [get_bd_intf_pins S_AXI] [get_bd_intf_pins axi_gpio_11/S_AXI]
connect_bd_net [get_bd_pins RD] [get_bd_pins rtl_core_11/RD]
connect_bd_net [get_bd_pins aclk] [get_bd_pins axi_gpio_11/s_axi_aclk] [get_bd_pins rtl_core_11/Clk]
connect_bd_net [get_bd_pins aresetn] [get_bd_pins axi_gpio_11/s_axi_aresetn] [get_bd_pins rtl_core_11/Reset]
connect_bd_net [get_bd_pins axi_gpio_11/gpio_io_o] [get_bd_pins rtl_core_11/PS_SERIAL_CONFIG_DataRead_ErrorOk_Send_DataIn]
connect_bd_net [get_bd_pins rtl_core_11/PS_out] [get_bd_pins axi_gpio_11/gpio2_io_i]
connect_bd_net [get_bd_pins rtl_core_11/TD] [get_bd_pins TD]
connect_bd_net [get_bd_pins rtl_core_11/TX_RDY_EMPTY] [get_bd_pins irq_raw]

current_bd_instance /Transceiver_12
connect_bd_intf_net [get_bd_intf_pins S_AXI] [get_bd_intf_pins axi_gpio_12/S_AXI]
connect_bd_net [get_bd_pins RD] [get_bd_pins rtl_core_12/RD]
connect_bd_net [get_bd_pins aclk] [get_bd_pins axi_gpio_12/s_axi_aclk] [get_bd_pins rtl_core_12/Clk]
connect_bd_net [get_bd_pins aresetn] [get_bd_pins axi_gpio_12/s_axi_aresetn] [get_bd_pins rtl_core_12/Reset]
connect_bd_net [get_bd_pins axi_gpio_12/gpio_io_o] [get_bd_pins rtl_core_12/PS_SERIAL_CONFIG_DataRead_ErrorOk_Send_DataIn]
connect_bd_net [get_bd_pins rtl_core_12/PS_out] [get_bd_pins axi_gpio_12/gpio2_io_i]
connect_bd_net [get_bd_pins rtl_core_12/TD] [get_bd_pins TD]
connect_bd_net [get_bd_pins rtl_core_12/TX_RDY_EMPTY] [get_bd_pins irq_raw]

current_bd_instance /Transceiver_13
connect_bd_intf_net [get_bd_intf_pins S_AXI] [get_bd_intf_pins axi_gpio_13/S_AXI]
connect_bd_net [get_bd_pins RD] [get_bd_pins rtl_core_13/RD]
connect_bd_net [get_bd_pins aclk] [get_bd_pins axi_gpio_13/s_axi_aclk] [get_bd_pins rtl_core_13/Clk]
connect_bd_net [get_bd_pins aresetn] [get_bd_pins axi_gpio_13/s_axi_aresetn] [get_bd_pins rtl_core_13/Reset]
connect_bd_net [get_bd_pins axi_gpio_13/gpio_io_o] [get_bd_pins rtl_core_13/PS_SERIAL_CONFIG_DataRead_ErrorOk_Send_DataIn]
connect_bd_net [get_bd_pins rtl_core_13/PS_out] [get_bd_pins axi_gpio_13/gpio2_io_i]
connect_bd_net [get_bd_pins rtl_core_13/TD] [get_bd_pins TD]
connect_bd_net [get_bd_pins rtl_core_13/TX_RDY_EMPTY] [get_bd_pins irq_raw]

current_bd_instance /
connect_bd_intf_net [get_bd_intf_pins axi_smc/M00_AXI] [get_bd_intf_pins Transceiver_0/S_AXI]
connect_bd_intf_net [get_bd_intf_pins axi_smc/M01_AXI] [get_bd_intf_pins Transceiver_1/S_AXI]
connect_bd_intf_net [get_bd_intf_pins axi_smc/M02_AXI] [get_bd_intf_pins Transceiver_2/S_AXI]
connect_bd_intf_net [get_bd_intf_pins axi_smc/M03_AXI] [get_bd_intf_pins Transceiver_3/S_AXI]
connect_bd_intf_net [get_bd_intf_pins axi_smc/M04_AXI] [get_bd_intf_pins Transceiver_4/S_AXI]
connect_bd_intf_net [get_bd_intf_pins axi_smc/M05_AXI] [get_bd_intf_pins Transceiver_5/S_AXI]
connect_bd_intf_net [get_bd_intf_pins axi_smc/M06_AXI] [get_bd_intf_pins Transceiver_6/S_AXI]
connect_bd_intf_net [get_bd_intf_pins axi_smc/M07_AXI] [get_bd_intf_pins Transceiver_7/S_AXI]
connect_bd_intf_net [get_bd_intf_pins axi_smc/M08_AXI] [get_bd_intf_pins Transceiver_8/S_AXI]
connect_bd_intf_net [get_bd_intf_pins axi_smc/M09_AXI] [get_bd_intf_pins Transceiver_9/S_AXI]
connect_bd_intf_net [get_bd_intf_pins axi_smc/M10_AXI] [get_bd_intf_pins Transceiver_10/S_AXI]
connect_bd_intf_net [get_bd_intf_pins axi_smc/M11_AXI] [get_bd_intf_pins Transceiver_11/S_AXI]
connect_bd_intf_net [get_bd_intf_pins axi_smc/M12_AXI] [get_bd_intf_pins Transceiver_12/S_AXI]
connect_bd_intf_net [get_bd_intf_pins axi_smc/M13_AXI] [get_bd_intf_pins Transceiver_13/S_AXI]
connect_bd_intf_net [get_bd_intf_pins axi_smc/M14_AXI] [get_bd_intf_pins axi_intc_global/s_axi]
connect_bd_intf_net [get_bd_intf_pins zynq_ultra_ps_e_0/M_AXI_HPM0_FPD] [get_bd_intf_pins axi_smc/S00_AXI]
connect_bd_net -net RD_0_1 [get_bd_ports UART_0_RX] [get_bd_pins Transceiver_0/RD]
connect_bd_net -net RD_0_2 [get_bd_ports UART_1_RX] [get_bd_pins Transceiver_1/RD]
connect_bd_net -net RD_0_3 [get_bd_ports UART_2_RX] [get_bd_pins Transceiver_2/RD]
connect_bd_net -net RD_0_4 [get_bd_ports UART_3_RX] [get_bd_pins Transceiver_3/RD]
connect_bd_net -net RD_0_5 [get_bd_ports UART_4_RX] [get_bd_pins Transceiver_4/RD]
connect_bd_net -net RD_0_6 [get_bd_ports UART_5_RX] [get_bd_pins Transceiver_5/RD]
connect_bd_net -net RD_0_7 [get_bd_ports UART_6_RX] [get_bd_pins Transceiver_6/RD]
connect_bd_net -net RD_0_8 [get_bd_ports UART_7_RX] [get_bd_pins Transceiver_7/RD]
connect_bd_net -net RD_0_9 [get_bd_ports UART_8_RX] [get_bd_pins Transceiver_8/RD]
connect_bd_net -net RD_0_10 [get_bd_ports UART_9_RX] [get_bd_pins Transceiver_9/RD]
connect_bd_net -net RD_0_11 [get_bd_ports UART_10_RX] [get_bd_pins Transceiver_10/RD]
connect_bd_net -net RD_0_12 [get_bd_ports UART_11_RX] [get_bd_pins Transceiver_11/RD]
connect_bd_net -net RD_0_13 [get_bd_ports UART_12_RX] [get_bd_pins Transceiver_12/RD]
connect_bd_net [get_bd_pins Transceiver_0/TD] [get_bd_ports UART_0_TX]
connect_bd_net [get_bd_pins Transceiver_0/irq_raw] [get_bd_pins irq_concat/In0]
connect_bd_net [get_bd_pins Transceiver_10/TD] [get_bd_ports UART_10_TX]
connect_bd_net [get_bd_pins Transceiver_10/irq_raw] [get_bd_pins irq_concat/In10]
connect_bd_net [get_bd_pins Transceiver_11/TD] [get_bd_ports UART_11_TX]
connect_bd_net [get_bd_pins Transceiver_11/irq_raw] [get_bd_pins irq_concat/In11]
connect_bd_net [get_bd_pins Transceiver_12/TD] [get_bd_ports UART_12_TX]
connect_bd_net [get_bd_pins Transceiver_12/irq_raw] [get_bd_pins irq_concat/In12]
connect_bd_net [get_bd_pins Transceiver_13/irq_raw] [get_bd_pins irq_concat/In13]
connect_bd_net [get_bd_pins Transceiver_1/TD] [get_bd_ports UART_1_TX]
connect_bd_net [get_bd_pins Transceiver_1/irq_raw] [get_bd_pins irq_concat/In1]
connect_bd_net [get_bd_pins Transceiver_2/TD] [get_bd_ports UART_2_TX]
connect_bd_net [get_bd_pins Transceiver_2/irq_raw] [get_bd_pins irq_concat/In2]
connect_bd_net [get_bd_pins Transceiver_3/TD] [get_bd_ports UART_3_TX]
connect_bd_net [get_bd_pins Transceiver_3/irq_raw] [get_bd_pins irq_concat/In3]
connect_bd_net [get_bd_pins Transceiver_4/TD] [get_bd_ports UART_4_TX]
connect_bd_net [get_bd_pins Transceiver_4/irq_raw] [get_bd_pins irq_concat/In4]
connect_bd_net [get_bd_pins Transceiver_5/TD] [get_bd_ports UART_5_TX]
connect_bd_net [get_bd_pins Transceiver_5/irq_raw] [get_bd_pins irq_concat/In5]
connect_bd_net [get_bd_pins Transceiver_6/TD] [get_bd_ports UART_6_TX]
connect_bd_net [get_bd_pins Transceiver_6/irq_raw] [get_bd_pins irq_concat/In6]
connect_bd_net [get_bd_pins Transceiver_7/TD] [get_bd_ports UART_7_TX]
connect_bd_net [get_bd_pins Transceiver_7/irq_raw] [get_bd_pins irq_concat/In7]
connect_bd_net [get_bd_pins Transceiver_8/TD] [get_bd_ports UART_8_TX]
connect_bd_net [get_bd_pins Transceiver_8/irq_raw] [get_bd_pins irq_concat/In8]
connect_bd_net [get_bd_pins Transceiver_9/TD] [get_bd_ports UART_9_TX]
connect_bd_net [get_bd_pins Transceiver_9/irq_raw] [get_bd_pins irq_concat/In9]
connect_bd_net [get_bd_pins axi_intc_global/irq] [get_bd_pins zynq_ultra_ps_e_0/pl_ps_irq0]
connect_bd_net [get_bd_pins irq_concat/dout] [get_bd_pins axi_intc_global/intr]
connect_bd_net [get_bd_pins rst_gen/peripheral_aresetn] \
  [get_bd_pins axi_smc/aresetn] [get_bd_pins axi_intc_global/s_axi_aresetn] [get_bd_pins Transceiver_0/aresetn] \
  [get_bd_pins Transceiver_1/aresetn] [get_bd_pins Transceiver_2/aresetn] [get_bd_pins Transceiver_3/aresetn] \
  [get_bd_pins Transceiver_4/aresetn] [get_bd_pins Transceiver_5/aresetn] [get_bd_pins Transceiver_6/aresetn] \
  [get_bd_pins Transceiver_7/aresetn] [get_bd_pins Transceiver_8/aresetn] [get_bd_pins Transceiver_9/aresetn] \
  [get_bd_pins Transceiver_10/aresetn] [get_bd_pins Transceiver_11/aresetn] [get_bd_pins Transceiver_12/aresetn] \
  [get_bd_pins Transceiver_13/aresetn]
connect_bd_net [get_bd_pins tie_idle_13/dout] [get_bd_pins Transceiver_13/RD]
connect_bd_net [get_bd_pins zynq_ultra_ps_e_0/pl_clk0] \
  [get_bd_pins rst_gen/slowest_sync_clk] [get_bd_pins axi_smc/aclk] [get_bd_pins axi_intc_global/s_axi_aclk] \
  [get_bd_pins Transceiver_0/aclk] [get_bd_pins Transceiver_1/aclk] [get_bd_pins Transceiver_2/aclk] \
  [get_bd_pins Transceiver_3/aclk] [get_bd_pins Transceiver_4/aclk] [get_bd_pins Transceiver_5/aclk] \
  [get_bd_pins Transceiver_6/aclk] [get_bd_pins Transceiver_7/aclk] [get_bd_pins Transceiver_8/aclk] \
  [get_bd_pins Transceiver_9/aclk] [get_bd_pins Transceiver_10/aclk] [get_bd_pins Transceiver_11/aclk] \
  [get_bd_pins Transceiver_12/aclk] [get_bd_pins Transceiver_13/aclk] [get_bd_pins zynq_ultra_ps_e_0/maxihpm0_fpd_aclk]
connect_bd_net [get_bd_pins zynq_ultra_ps_e_0/pl_resetn0] [get_bd_pins rst_gen/ext_reset_in]

# ---- address map ----
assign_bd_address -offset 0x00A0000000 -range 4K -target_address_space [get_bd_addr_spaces zynq_ultra_ps_e_0/Data] [get_bd_addr_segs Transceiver_0/axi_gpio_0/S_AXI/Reg]
assign_bd_address -offset 0x00A0001000 -range 4K -target_address_space [get_bd_addr_spaces zynq_ultra_ps_e_0/Data] [get_bd_addr_segs Transceiver_1/axi_gpio_1/S_AXI/Reg]
assign_bd_address -offset 0x00A0002000 -range 4K -target_address_space [get_bd_addr_spaces zynq_ultra_ps_e_0/Data] [get_bd_addr_segs Transceiver_2/axi_gpio_2/S_AXI/Reg]
assign_bd_address -offset 0x00A0003000 -range 4K -target_address_space [get_bd_addr_spaces zynq_ultra_ps_e_0/Data] [get_bd_addr_segs Transceiver_3/axi_gpio_3/S_AXI/Reg]
assign_bd_address -offset 0x00A0004000 -range 4K -target_address_space [get_bd_addr_spaces zynq_ultra_ps_e_0/Data] [get_bd_addr_segs Transceiver_4/axi_gpio_4/S_AXI/Reg]
assign_bd_address -offset 0x00A0005000 -range 4K -target_address_space [get_bd_addr_spaces zynq_ultra_ps_e_0/Data] [get_bd_addr_segs Transceiver_5/axi_gpio_5/S_AXI/Reg]
assign_bd_address -offset 0x00A0006000 -range 4K -target_address_space [get_bd_addr_spaces zynq_ultra_ps_e_0/Data] [get_bd_addr_segs Transceiver_6/axi_gpio_6/S_AXI/Reg]
assign_bd_address -offset 0x00A0007000 -range 4K -target_address_space [get_bd_addr_spaces zynq_ultra_ps_e_0/Data] [get_bd_addr_segs Transceiver_7/axi_gpio_7/S_AXI/Reg]
assign_bd_address -offset 0x00A0008000 -range 4K -target_address_space [get_bd_addr_spaces zynq_ultra_ps_e_0/Data] [get_bd_addr_segs Transceiver_8/axi_gpio_8/S_AXI/Reg]
assign_bd_address -offset 0x00A0009000 -range 4K -target_address_space [get_bd_addr_spaces zynq_ultra_ps_e_0/Data] [get_bd_addr_segs Transceiver_9/axi_gpio_9/S_AXI/Reg]
assign_bd_address -offset 0x00A000A000 -range 4K -target_address_space [get_bd_addr_spaces zynq_ultra_ps_e_0/Data] [get_bd_addr_segs Transceiver_10/axi_gpio_10/S_AXI/Reg]
assign_bd_address -offset 0x00A000B000 -range 4K -target_address_space [get_bd_addr_spaces zynq_ultra_ps_e_0/Data] [get_bd_addr_segs Transceiver_11/axi_gpio_11/S_AXI/Reg]
assign_bd_address -offset 0x00A000C000 -range 4K -target_address_space [get_bd_addr_spaces zynq_ultra_ps_e_0/Data] [get_bd_addr_segs Transceiver_12/axi_gpio_12/S_AXI/Reg]
assign_bd_address -offset 0x00A000D000 -range 4K -target_address_space [get_bd_addr_spaces zynq_ultra_ps_e_0/Data] [get_bd_addr_segs Transceiver_13/axi_gpio_13/S_AXI/Reg]
assign_bd_address -offset 0x00A000E000 -range 4K -target_address_space [get_bd_addr_spaces zynq_ultra_ps_e_0/Data] [get_bd_addr_segs axi_intc_global/S_AXI/Reg]

validate_bd_design
save_bd_design
